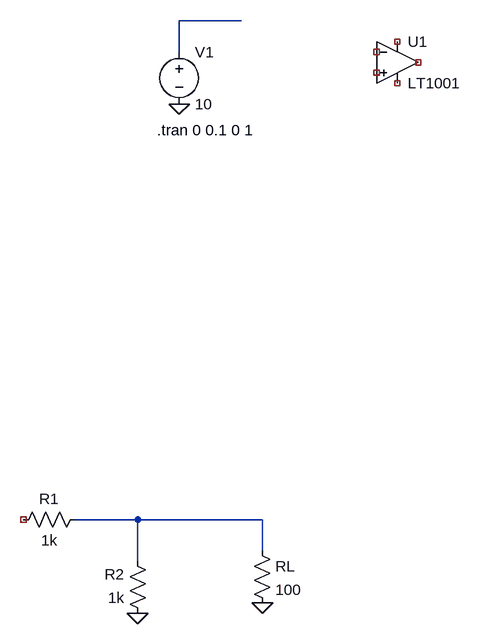
[diagram p0: schematic PSUTrial2.asc]
PSUTrial2.asc, the LTspice schematic file:
Version 4
SHEET 1 880 1012
WIRE 224 80 128 80
WIRE 128 128 128 80
WIRE 64 848 -32 848
WIRE 256 848 64 848
WIRE 256 896 256 848
WIRE 64 912 64 848
FLAG 128 208 0
FLAG 64 992 0
FLAG 256 976 0
SYMBOL voltage 128 112 R0
WINDOW 123 0 0 Left 0
WINDOW 39 0 0 Left 0
SYMATTR InstName V1
SYMATTR Value 10
SYMBOL res -16 832 R90
WINDOW 0 0 56 VBottom 2
WINDOW 3 32 56 VTop 2
SYMATTR InstName R1
SYMATTR Value 1k
SYMATTR SpiceLine tol=5 pwr=0.5
SYMBOL res 80 1008 R180
WINDOW 0 36 76 Left 2
WINDOW 3 36 40 Left 2
SYMATTR InstName R2
SYMATTR Value 1k
SYMATTR SpiceLine tol=5 pwr=0.5
SYMBOL res 240 880 R0
SYMATTR InstName RL
SYMATTR Value 100
SYMBOL OpAmps\\LT1001 464 80 R0
SYMATTR InstName U1
TEXT 94 248 Left 2 !.tran 0 0.1 0 1

The netlist it stands for:
* PSUTrial2.asc
V1 N001 0 10
R1 N002 NC_01 1k tol=5 pwr=0.5
R2 0 N002 1k tol=5 pwr=0.5
RL N002 0 100
XU1 NC_02 NC_03 NC_04 NC_05 NC_06 LT1001  ; pins In+ In- V+ V- OUT
.tran 0 0.1 0 1
.lib LTC.lib
.backanno
.end